# EAGLE design The_QwiicNES (EAGLE 9.5.2)
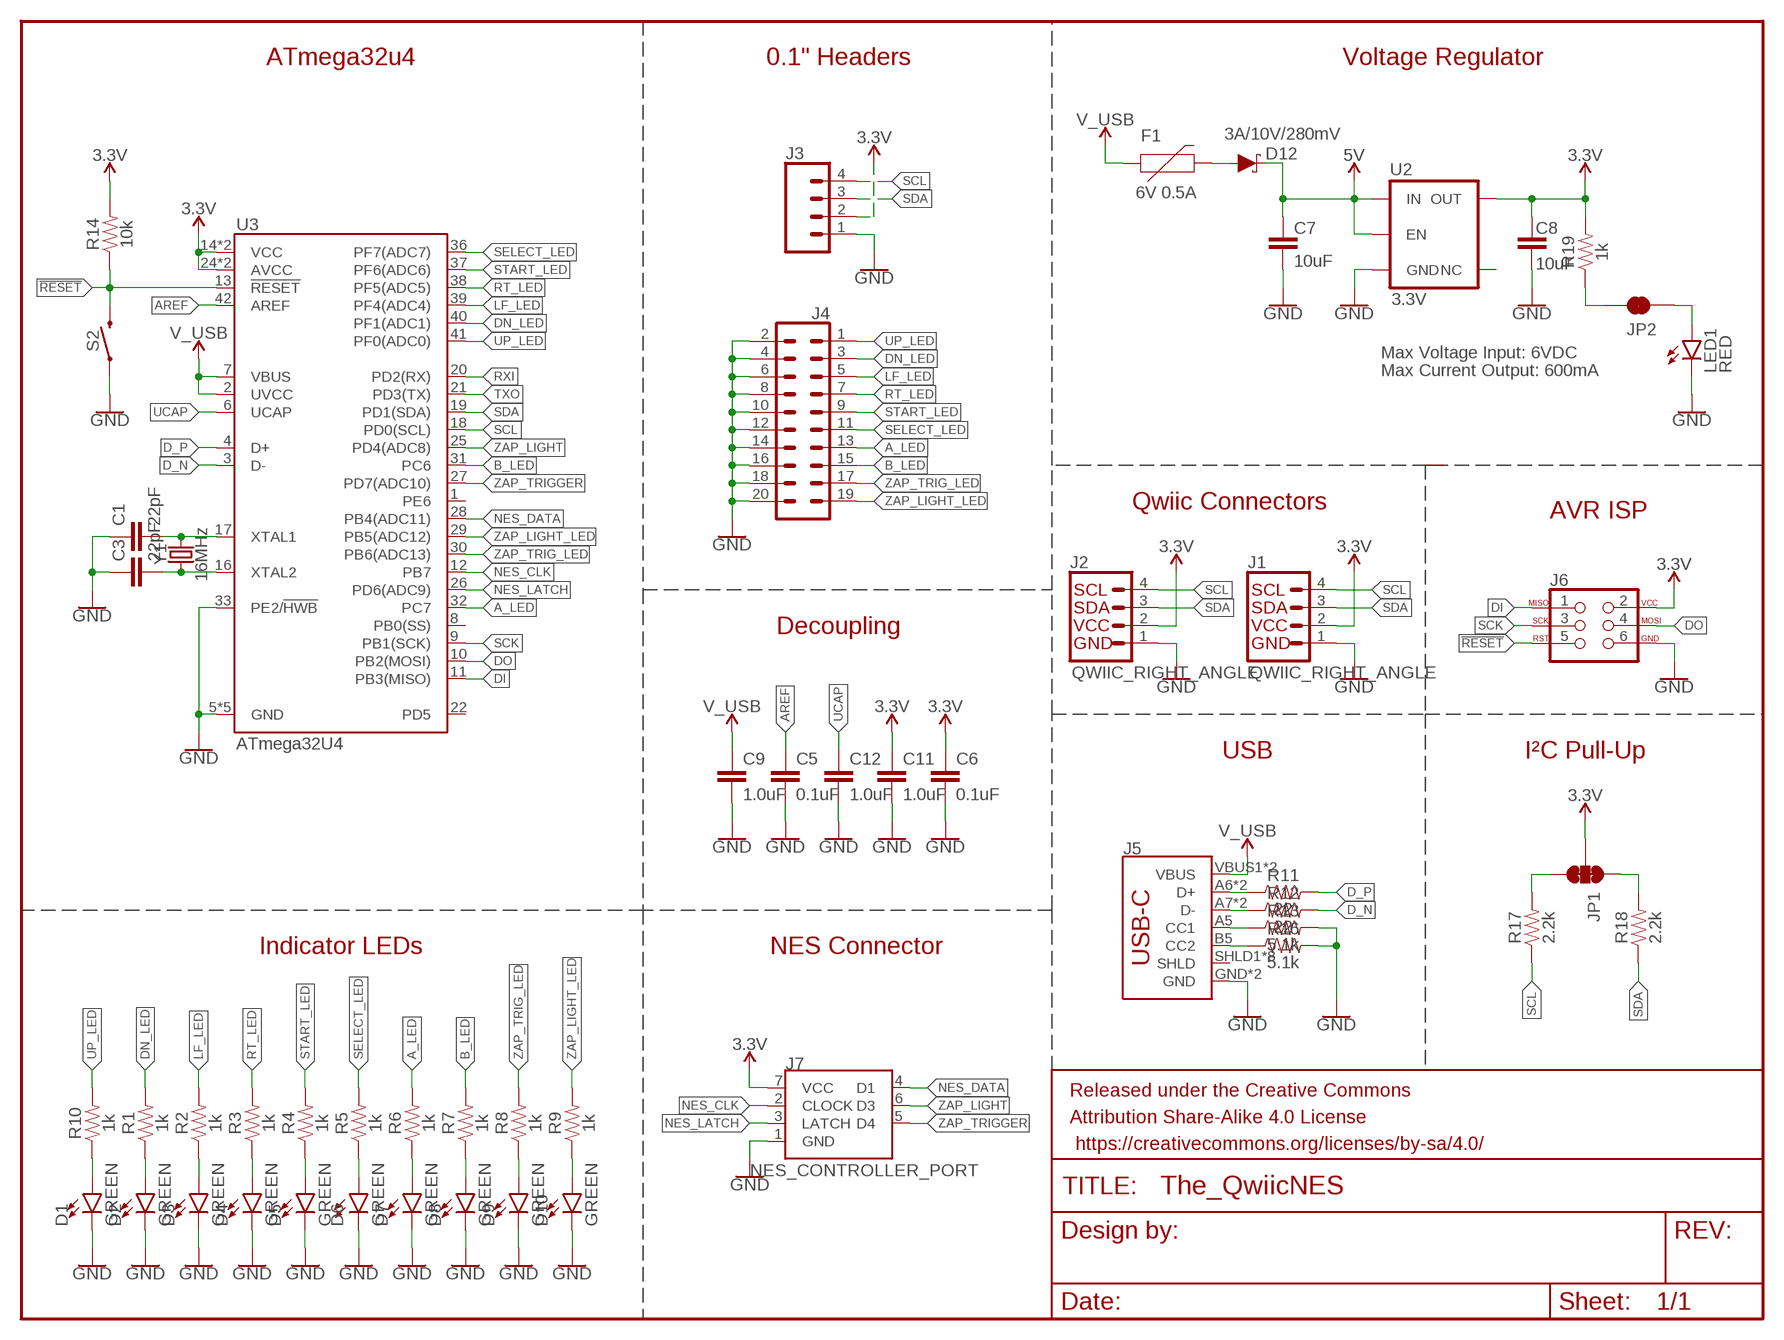
[diagram p0: schematic, sheet 1]

## Parts
C1  22pF  22PF-0603-50V-5%  [0603]
C3  22pF  22PF-0603-50V-5%  [0603]
C5  0.1uF  0.1UF-0603-25V-(+80/-20%)  [0603]
C6  0.1uF  0.1UF-0603-25V-(+80/-20%)  [0603]
C7  10uF  10UF-0603-6.3V-20%  [0603]
C8  10uF  10UF-0603-6.3V-20%  [0603]
C9  1.0uF  1.0UF-0603-16V-10%  [0603]
C11  1.0uF  1.0UF-0603-16V-10%  [0603]
C12  1.0uF  1.0UF-0603-16V-10%  [0603]
D1  GREEN  LED-GREEN0603  [LED-0603]
D2  GREEN  LED-GREEN0603  [LED-0603]
D3  GREEN  LED-GREEN0603  [LED-0603]
D4  GREEN  LED-GREEN0603  [LED-0603]
D5  GREEN  LED-GREEN0603  [LED-0603]
D6  GREEN  LED-GREEN0603  [LED-0603]
D7  GREEN  LED-GREEN0603  [LED-0603]
D8  GREEN  LED-GREEN0603  [LED-0603]
D9  GREEN  LED-GREEN0603  [LED-0603]
D10  GREEN  LED-GREEN0603  [LED-0603]
D12  3A/10V/280mV  DIODE-SCHOTTKY-BAT60A  [SOD-323]
F1  6V 0.5A  PPTC_6V500MA  [0805]
FRAME1  FRAME-LETTER  [CREATIVE_COMMONS]
J1  QWIIC_RIGHT_ANGLE  QWIIC_CONNECTORJS-1MM  [JST04_1MM_RA]
J2  QWIIC_RIGHT_ANGLE  QWIIC_CONNECTORJS-1MM  [JST04_1MM_RA]
J3  CONN_041X04_NO_SILK  [1X04_NO_SILK]
J4  CONN_10X2NOSILK  [2X10_NOSILK]
J5  USB_C5  [USB-C-16P-5]
J6  AVR_SPI_PROG_3X2TESTPOINTS  [2X3_TEST_POINTS]
J7  NES_CONTROLLER_PORT  [NES_CONTROLLER_PORT_7PIN_90]
JP1  JUMPER-SMT_3_2-NC_TRACE_SILK  [SMT-JUMPER_3_2-NC_TRACE_SILK]
JP2  JUMPER-SMT_2_NC_TRACE_SILK  [SMT-JUMPER_2_NC_TRACE_SILK]
LED1  RED  LED-RED0603  [LED-0603]
R1  1k  1KOHM-0603-1/10W-1%  [0603]
R2  1k  1KOHM-0603-1/10W-1%  [0603]
R3  1k  1KOHM-0603-1/10W-1%  [0603]
R4  1k  1KOHM-0603-1/10W-1%  [0603]
R5  1k  1KOHM-0603-1/10W-1%  [0603]
R6  1k  1KOHM-0603-1/10W-1%  [0603]
R7  1k  1KOHM-0603-1/10W-1%  [0603]
R8  1k  1KOHM-0603-1/10W-1%  [0603]
R9  1k  1KOHM-0603-1/10W-1%  [0603]
R10  1k  1KOHM-0603-1/10W-1%  [0603]
R11  22  22OHM-0603-1/10W-1%  [0603]
R12  22  22OHM-0603-1/10W-1%  [0603]
R13  5.1k  5.1KOHM5.1KOHM-0603-1/10W-1%  [0603]
R14  10k  10KOHM-0603-1/10W-1%  [0603]
R16  5.1k  5.1KOHM5.1KOHM-0603-1/10W-1%  [0603]
R17  2.2k  2.2KOHM-0603-1/10W-1%  [0603]
R18  2.2k  2.2KOHM-0603-1/10W-1%  [0603]
R19  1k  1KOHM-0603-1/10W-1%  [0603]
S2  MOMENTARY-SWITCH-SPST-SMD-5.2MM-TALL  [TACTILE_SWITCH_SMD_5.2MM]
U2  3.3V  V_REG_AP2112K-3.3V  [SOT23-5]
U3  ATmega32U4  ATMEGA32U41:1  [QFN-44-NOPAD_1:1]
Y1  16MHz  CRYSTAL-16MHZSMD-2X1.6  [CRYSTAL-SMD-2.0X1.6MM]

## Nets
3.3V: C6.1 C8.2 C11.1 J1.2 J2.2 J3.2 J6.2 J7.7(VCC) JP1.2 R14.2 R19.2 U2.5(OUT) U3.14(VCC) U3.24(AVCC) U3.34(VCC) U3.44(AVCC)
5V [vcc]: C7.2 D12.C U2.1(IN) U2.3(EN)
!RESET: J6.5 R14.1 S2.3 U3.13(!RESET)
A_LED: J4.13 R6.2 U3.32(PC7)
AREF: C5.1 U3.42(AREF)
B_LED: J4.15 R7.2 U3.31(PC6)
D-_HV: J5.A7(D-) J5.B7(D-) R12.1
D_N: R12.2 U3.3(D-)
D_P: R11.2 U3.4(D+)
DI: J6.1 U3.11(PB3(MISO))
DN_LED: J4.3 R1.2 U3.40(PF1(ADC1))
DO: J6.4 U3.10(PB2(MOSI))
DP_HV: J5.A6(D+) J5.B6(D+) R11.1
GND: C1.1 C3.1 C5.2 C6.2 C7.1 C8.1 C9.2 C11.2 C12.2 D1.C D2.C D3.C D4.C D5.C D6.C D7.C D8.C D9.C D10.C J1.1 J2.1 J3.1 J4.2 J4.4 J4.6 J4.8 J4.10 J4.12 J4.14 J4.16 J4.18 J4.20 J5.GND J5.GND2(GND) J6.6 J7.1(GND) LED1.C R13.2 R16.2 S2.1 U2.2(GND) U3.5(GND) U3.15(GND) U3.23(GND) U3.33(PE2/!HWB) U3.35(GND) U3.43(GND)
LF_LED: J4.5 R2.2 U3.39(PF4(ADC4))
N$1: C3.2 U3.16(XTAL2) Y1.1
N$2: C1.2 U3.17(XTAL1) Y1.3
N$3: D1.A R10.1
N$4: D2.A R1.1
N$5: D3.A R2.1
N$6: D4.A R3.1
N$7: D5.A R4.1
N$8: D6.A R5.1
N$9: J5.A5(CC1) R13.1
N$10: J5.B5(CC2) R16.1
N$11: D8.A R7.1
N$12: D7.A R6.1
N$13: JP2.2 R19.1
N$14: JP2.1 LED1.A
N$21: JP1.3 R17.2
N$22: JP1.1 R18.2
N$23: D10.A R9.1
N$24: D9.A R8.1
NES_CLK: J7.2(CLOCK) U3.12(PB7)
NES_DATA: J7.4(D1) U3.28(PB4(ADC11))
NES_LATCH: J7.3(LATCH) U3.26(PD6(ADC9))
RT_LED: J4.7 R3.2 U3.38(PF5(ADC5))
RXI: U3.20(PD2(RX))
SCK: J6.3 U3.9(PB1(SCK))
SCL: J1.4 J2.4 J3.4 R17.1 U3.18(PD0(SCL))
SDA: J1.3 J2.3 J3.3 R18.1 U3.19(PD1(SDA))
SELECT_LED: J4.11 R5.2 U3.36(PF7(ADC7))
START_LED: J4.9 R4.2 U3.37(PF6(ADC6))
TXO: U3.21(PD3(TX))
UCAP: C12.1 U3.6(UCAP)
UP_LED: J4.1 R10.2 U3.41(PF0(ADC0))
USB_RAW: D12.A F1.2
V_USB: C9.1 F1.1 J5.VBUS1(VBUS) J5.VBUS2(VBUS) U3.2(UVCC) U3.7(VBUS)
ZAP_LIGHT: J7.6(D3) U3.25(PD4(ADC8))
ZAP_LIGHT_LED: J4.19 R9.2 U3.29(PB5(ADC12))
ZAP_TRIG_LED: J4.17 R8.2 U3.30(PB6(ADC13))
ZAP_TRIGGER: J7.5(D4) U3.27(PD7(ADC10))
Unconnected: J5.SHLD1(SHLD) J5.SHLD2(SHLD) J5.SHLD3(SHLD) J5.SHLD4(SHLD) J5.SHLD5(SHLD) J5.SHLD6(SHLD) J5.SHLD7(SHLD) J5.SHLD8(SHLD) U2.4(NC) U3.1(PE6) U3.8(PB0(SS)) U3.22(PD5)

## Notes on the sheet
- ATmega32u4 | 0.1" Headers | Voltage Regulator
- Max Voltage Input: 6VDC
- Max Current Output: 600mA
- Qwiic Connectors
- AVR ISP
- Decoupling
- USB | I²C Pull-Up
- Indicator LEDs | NES Connector

## Library data of the parts
C1 C3 = SparkFun-Capacitors:22PF: 22pF ceramic capacitors A capacitor is a passive two-terminal electrical component used to store electrical energy temporarily in an electric field.; PROD_ID: CAP-07876
C5 C6 = SparkFun-Capacitors:0.1UF: 0.1µF ceramic capacitors A capacitor is a passive two-terminal electrical component used to store electrical energy temporarily in an electric field.; PROD_ID: CAP-00810
C7 C8 = SparkFun-Capacitors:10UF: 10.0µF ceramic capacitors A capacitor is a passive two-terminal electrical component used to store electrical energy temporarily in an electric field.; PROD_ID: CAP-11015
C9 C11 C12 = SparkFun-Capacitors:1.0UF: 1µF ceramic capacitors A capacitor is a passive two-terminal electrical component used to store electrical energy temporarily in an electric field.; PROD_ID: CAP-00868
D1-D10 = SparkFun-LED:LED-GREEN: Green SMD LED Used in manufacturing of various products at SparkFun Packages: 0603 - SMD 0603 package [Product Link] <http://www.futureelectronics.com/en/technologies/semiconductors/optoelectronics/leds/Pages/9894312-LTST-C190GKT.aspx?CrossPart=HSMG-C190&IM=0> LilyPad 1206 - SMD1206 LilyPad package [Product Link] <http://www.futureelectronics.com/en/Technologies/Product.aspx?ProductID=IN150NGHARVATEKCORPORATION2049943&IM=0> 1206 - SMD1206 package [Product Link] <http://www.futureelectronics.com/en/technologies/semiconductors/optoelectronics/leds/Pages/8315665-LTST-C150KGKT.aspx?IM=0> 1206 Bottom Mount -SMD 1206 Bottom Mount [Product Link] <http://www.digikey.com/product-detail/en/lite-on-inc/LTST-C230KGKT/160-1456-1-ND/386854> SparkFun Products: Pro Mini 328 -5V <https://www.sparkfun.com/products/821> RedBoard <https://www.sparkfun.com/products/12757> MP3 Trigger <https://www.sparkfun.com/products/13720> Makey Makey <https://www.sparkfun.com/products/11076>; PROD_ID: DIO-00821
D12 = SparkFun-DiscreteSemi:DIODE-SCHOTTKY: Schottky diode A Schottky diode is a semiconductor diode which has a low forward voltage drop and a very fast switching action.; PROD_ID: DIO-14072
F1 = SparkFun-Fuses:PPTC: Resettable Fuse PPTC Resettable Fuse. Really a sort of resistor with a polymeric positive temperature coefficient whose resistance increases dramatically with an increase in temperature. When heated by the power passing through the resistance rises causing the current to be limited, protecting the circuit. This is achieved by the transition of the polymer from a crystalline to an amorphous state where the conductive carbon separates breaking the conductive pathways found in the cool crystalline structure. When a PPTC cools back down it resumes conducting letting the circuit turn back on. SparkFun Products: SparkFun RedBoard - Programmed with Arduino <https://www.sparkfun.com/products/12757> Pro Micro - 5V/16MHz <https://www.sparkfun.com/products/12640> Arduino Pro 328 - 5V/16MHz <https://www.sparkfun.com/products/10915> MP3 Trigger <https://www.sparkfun.com/products/13720>; PROD_ID: RES-13945
FRAME1 = SparkFun-Aesthetics:FRAME-LETTER: Schematic Frame - Letter Standard 8.5x11 US Letter frame
J1 J2 = SparkFun-Connectors:QWIIC_CONNECTOR: SparkFun I2C Standard Qwiic Connector An SMD 1mm pitch JST connector makes it easy and quick (get it? Qwiic?) to connect I2C devices to each other. The Qwiic system <http://www.sparkfun.com/qwiic> enables fast and solderless connection between popular platforms and various sensors and actuators. We carry 200mm <https://www.sparkfun.com/products/14204>, 100mm <https://www.sparkfun.com/products/14205>, 50mm <https://www.sparkfun.com/products/14206>, and breadboard friendly <https://www.sparkfun.com/products/14207> Qwiic cables. We also offer 10 pcs strips <https://www.sparkfun.com/products/14323> the SMD connectors.; PROD_ID: CONN-13694
J3 = SparkFun-Connectors:CONN_04: Multi connection point. Often used as Generic Header-pin footprint for 0.1 inch spaced/style header connections On any of the 0.1 inch spaced packages, you can populate with these: Break Away Headers - Straight <https://www.sparkfun.com/products/116> (PRT-00116) Break Away Male Headers - Right Angle <https://www.sparkfun.com/products/553> (PRT-00553) Female Headers <https://www.sparkfun.com/products/115> (PRT-00115) Break Away Headers - Machine Pin <https://www.sparkfun.com/products/117> (PRT-00117) Break Away Female Headers - Swiss Machine Pin <https://www.sparkfun.com/products/743> (PRT-00743) For SCREWTERMINALS and SPRING TERMINALS visit here: Screw Terimnals on SparkFun.com <https://www.sparkfun.com/search/results?term=Screw+Terminals> (5mm/3.5mm/2.54mm spacing) This device is also useful as a general connection point to wire up your design to another part of your project. Our various solder wires solder well into these plated through hole pads. Hook-Up Wire - Assortment (Stranded, 22 AWG) <https://www.sparkfun.com/products/11375> (PRT-11375) Hook-Up Wire - Assortment (Solid Core, 22 AWG) <https://www.sparkfun.com/products/11367> (PRT-11367) View the entire wire category on our website here <https://www.sparkfun.com/categories/141> Special notes: Molex polarized connector foot print use with SKU : PRT-08231 with associated crimp pins and housings. 1MM SMD Version SKU: PRT-10208; PROD_ID: CONN-09696
J4 = SparkFun-Connectors:CONN_10X2: Multi connection point. Often used as Generic Header-pin footprint for 0.1 inch spaced/style header connections On any of the 0.1 inch spaced packages, you can populate with these: Break Away Headers - Straight <https://www.sparkfun.com/products/116> (PRT-00116) Break Away Male Headers - Right Angle <https://www.sparkfun.com/products/553> (PRT-00553) Female Headers <https://www.sparkfun.com/products/115> (PRT-00115) Break Away Headers - Machine Pin <https://www.sparkfun.com/products/117> (PRT-00117) Break Away Female Headers - Swiss Machine Pin <https://www.sparkfun.com/products/743> (PRT-00743) Special note about the "SPECIAL" package: This was SPECIALLY designed to be used with our Graphic LCD Backpack. Be sure you want to use this! It is not only staggered on each line of header holes, but IT IS ALSO offset of the center point of the top and bottom lines by 5 mil. This causes the headers to lock into place on the "standard" footprint on the LCD screen. The extra squares on the tdocu layer are there simply to reference other pins (if you were to actually populate a longer header than ten long - this is what we do with the backpacks).
J5 = USBC:USB_C: USB Type C 16Pin Connector Super Speed pins not available on the 16-pin purely SMD connector so this part is best for USB 2.0 implementations. D1 and D2 are tied together enabling D+/- no matter which way the cable is plugged into the connector. The two channel configuration pins (CC1/2) are exposed. These are normally connected to ground via 5.1k resistors but can be reconfigured for high current/high power applications.
J6 = SparkFun-Connectors:AVR_SPI_PROG_3X2: AVR ISP 6 Pin This is the reduced ISP connector for AVR programming. Common on Arduino. This footprint will take up less PCB space and can be used with a 10-pin to 6-pin adapter such as SKU: BOB-08508 **Special note about "TEST_POINT" package. The stop mask is on the top side, so if you want your programming test points to be on the bottom of your board, make sure to place this package on the bottom side of the board. This also ensure that the orientation to program from the bottom side will be correct. SparkFun Products: SparkFun ISP Pogo Adapter <https://www.sparkfun.com/products/11591> - NS Tiny AVR Programmer <https://www.sparkfun.com/products/11801> -PTH
J7 = NES:NES_CONTROLLER_PORT
JP1 = SparkFun-Jumpers:JUMPER-SMT_3_2-NC_TRACE: Normally closed trace jumper (2 of 2 connections) This jumper has a trace between all three pads so they are normally closed (NC). Use a razor knife to open the connection(s). For best results follow the IPC guidelines for cutting traces: Cutout at least 0.063 mm (0.005 in). Remove all loose material to clean up the cut area. Seal the cut with an approved epoxy. Reapply solder to reclose the connection(s).
JP2 = SparkFun-Jumpers:JUMPER-SMT_2_NC_TRACE: Normally closed trace jumper This jumper has a trace between two pads so it's normally closed (NC). Use a razor knife to open the connection. For best results follow the IPC guidelines for cutting traces: Cutout at least 0.063 mm (0.005 in). Remove all loose material to clean up the cut area. Seal the cut with an approved epoxy. Reapply solder to reclose the connection.
LED1 = SparkFun-LED:LED-RED: Red SMD LED Used in manufacturing of most products at SparkFun Packages: 0603 - SMD 0603 package [Product Link] <http://docs.avagotech.com/docs/AV02-0551EN> 0603 SMART - SMD 0603 SMART package ( more efficient and expensive)[Product Link] <http://www.osram-os.com/Graphics/XPic2/00077099_0.pdf> 1206 - SMD1206 package [Product Link] <https://www.sparkfun.com/datasheets/DevTools/LilyPad/Q150OVS4.pdff> SparkFun Products: Pro Mini 328 -5V <https://www.sparkfun.com/products/821> RedBoard <https://www.sparkfun.com/products/12757> IOIO-OTG <https://www.sparkfun.com/products/13613>; PROD_ID: DIO-00819
R1-R10 R19 = SparkFun-Resistors:1KOHM: 1kΩ resistor A resistor is a passive two-terminal electrical component that implements electrical resistance as a circuit element. Resistors act to reduce current flow, and, at the same time, act to lower voltage levels within circuits. - Wikipedia; PROD_ID: RES-07856
R11 R12 = SparkFun-Resistors:22OHM: 22Ω resistor A resistor is a passive two-terminal electrical component that implements electrical resistance as a circuit element. Resistors act to reduce current flow, and, at the same time, act to lower voltage levels within circuits. - Wikipedia; PROD_ID: RES-08698
R13 R16 = SparkFun-Resistors:5.1KOHM; PROD_ID: RES-12083
R14 = SparkFun-Resistors:10KOHM: 10kΩ resistor A resistor is a passive two-terminal electrical component that implements electrical resistance as a circuit element. Resistors act to reduce current flow, and, at the same time, act to lower voltage levels within circuits. - Wikipedia; PROD_ID: RES-00824
R17 R18 = SparkFun-Resistors:2.2KOHM: 2.2kΩ resistor A resistor is a passive two-terminal electrical component that implements electrical resistance as a circuit element. Resistors act to reduce current flow, and, at the same time, act to lower voltage levels within circuits. - Wikipedia; PROD_ID: RES-08272
S2 = SparkFun-Switches:MOMENTARY-SWITCH-SPST: Momentary Switch (Pushbutton) - SPST Normally-open (NO) SPST momentary switches (buttons, pushbuttons). Variants PTH-12MM - 12mm square, through-hole Momentary Pushbutton Switch - 12mm Square <https://www.sparkfun.com/products/9190> (COM-09190) PTH-6.0MM, PTH-6.0MM-KIT - 6.0mm square, through-hole Mini Pushbutton Switch <https://www.sparkfun.com/products/97> (COM-00097) KIT package intended for soldering kit's - only one side of pads' copper is exposed. PTH-RIGHT-ANGLE-KIT - Right-angle, through-hole Right Angle Tactile Button <https://www.sparkfun.com/products/10791> - Used on SparkFun BigTime Watch Kit <https://www.sparkfun.com/products/11734> SMD-12MM - 12mm square, surface-mount Tactile Button - SMD (12mm) <https://www.sparkfun.com/products/12993> (COM-12993) Used on SparkFun PicoBoard <https://www.sparkfun.com/products/11888> SMD-4.5MM - 4.5mm Square Trackball Switch Used on SparkFun Blackberry Trackballer Breakout <https://www.sparkfun.com/products/13169> SMD-4.6MMX2.8MM - 4.60mm x 2.80mm, surface mount Used on SparkFun SAMD21 Mini Breakout <https://www.sparkfun.com/products/13664> SMD-5.2MM, SMD-5.2-REDUNDANT - 5.2mm square, surface-mount Mini Pushbutton Switch - SMD <https://www.sparkfun.com/products/8720> (COM-08720) Used on Arduino Pro Mini <https://www.sparkfun.com/products/11114> REDUNDANT package connects both switch circuits together SMD-6.0X3.5MM - 6.0 x 3.5mm, surface mount Momentary Reset Switch SMD <https://www.sparkfun.com/products/8229> (COM-08229) SMD-6.2MM-TALL - 6.2mm square, surface mount Tactile Button - SMD (6mm) <https://www.sparkfun.com/products/12992> Used on SparkFun Digital Sandbox <https://www.sparkfun.com/products/12651> SMD-RIGHT-ANGLE - Right-angle, surface mount Used on SparkFun Block for Intel® Edison - Arduino <https://www.sparkfun.com/products/13036>; PROD_ID: SWCH-14139
U2 = SparkFun-IC-Power:V_REG_AP2112: AP2112 - 600mA CMOS LDO Regulator w/ Enable The AP2112 is CMOS process low dropout linear regulator with enable function, the regulator delivers a guaranteed 600mA (min.) continuous load current. Features Output Voltage Accuracy: ±1.5% Output Current: 600mA (Min.) Foldback Short Current Protection: 50mA Enable Function to Turn ON/OFF VOUT Low Dropout Voltage (3.3V): 250mV (Typ.) @IOUT=600mA Excellent Load Regulation: 0.2%/A (Typ.) Excellent Line Regulation: 0.02%/V (Typ.) Low Quiescent Current: 55μA (Typ.) Low Standby Current: 0.01μA (Typ.) Low Output Noise: 50μVRMS PSRR: 100Hz -65dB, 1kHz -65dB OTSD Protection Stable with 1.0μF Flexible Cap: Ceramic, Tantalum and Aluminum Electrolytic Operation Temperature Range: -40°C to 85°C ESD: MM 400V, HBM 4000V; PROD_ID: VREG-12457
U3 = SparkFun-IC-Microcontroller:ATMEGA32U4: Atmel MCU, 32KByte Atmel 44-pin 8-bit Microcontroller with 32KBytes of ISP Flash and USB Controller Datasheet <http://cdn.sparkfun.com/datasheets/Dev/Arduino/Boards/ATMega32U4.pdf> SparkFun Products LilyPad Arduino USB - ATmega32U4 Board <https://www.sparkfun.com/products/12049> (DEV-12049) Pro Micro - 5V/16MHz <https://www.sparkfun.com/products/12640> (DEV-12640) Pro Micro - 3.3V/8MHz <https://www.sparkfun.com/products/12587> (DEV-12587) Fio v3 - ATmega32U4 <https://www.sparkfun.com/products/11520> (DEV-11520) Qduino Mini <https://www.sparkfun.com/products/13614> (DEV-13614) Makey Makey - Standard Kit <https://www.sparkfun.com/products/11511> (WIG-11511) Makey Makey Deluxe Kit <https://www.sparkfun.com/products/11519> (WIG-11519); PROD_ID: IC-10828; VALUE: 32U4
Y1 = SparkFun-Clocks:CRYSTAL-16MHZ: 16MHz Crystal Digikey Example <http://www.digikey.com/product-search/en?keywords=535-9122-1-ND> Frequency: 16MHz Frequency Stability: ±50ppm Frequency Tolerance: ±20ppm Load Capacitance: 18pF SparkFun Products: Pro Micro -5V/16MHz <https://www.sparkfun.com/products/12640> SparkFun Serial Enabled LCD Kit <https://www.sparkfun.com/products/10097>; PROD_ID: XTAL-14681

## Net classes
0 default: width 0 mm, drill 0 mm

## Board
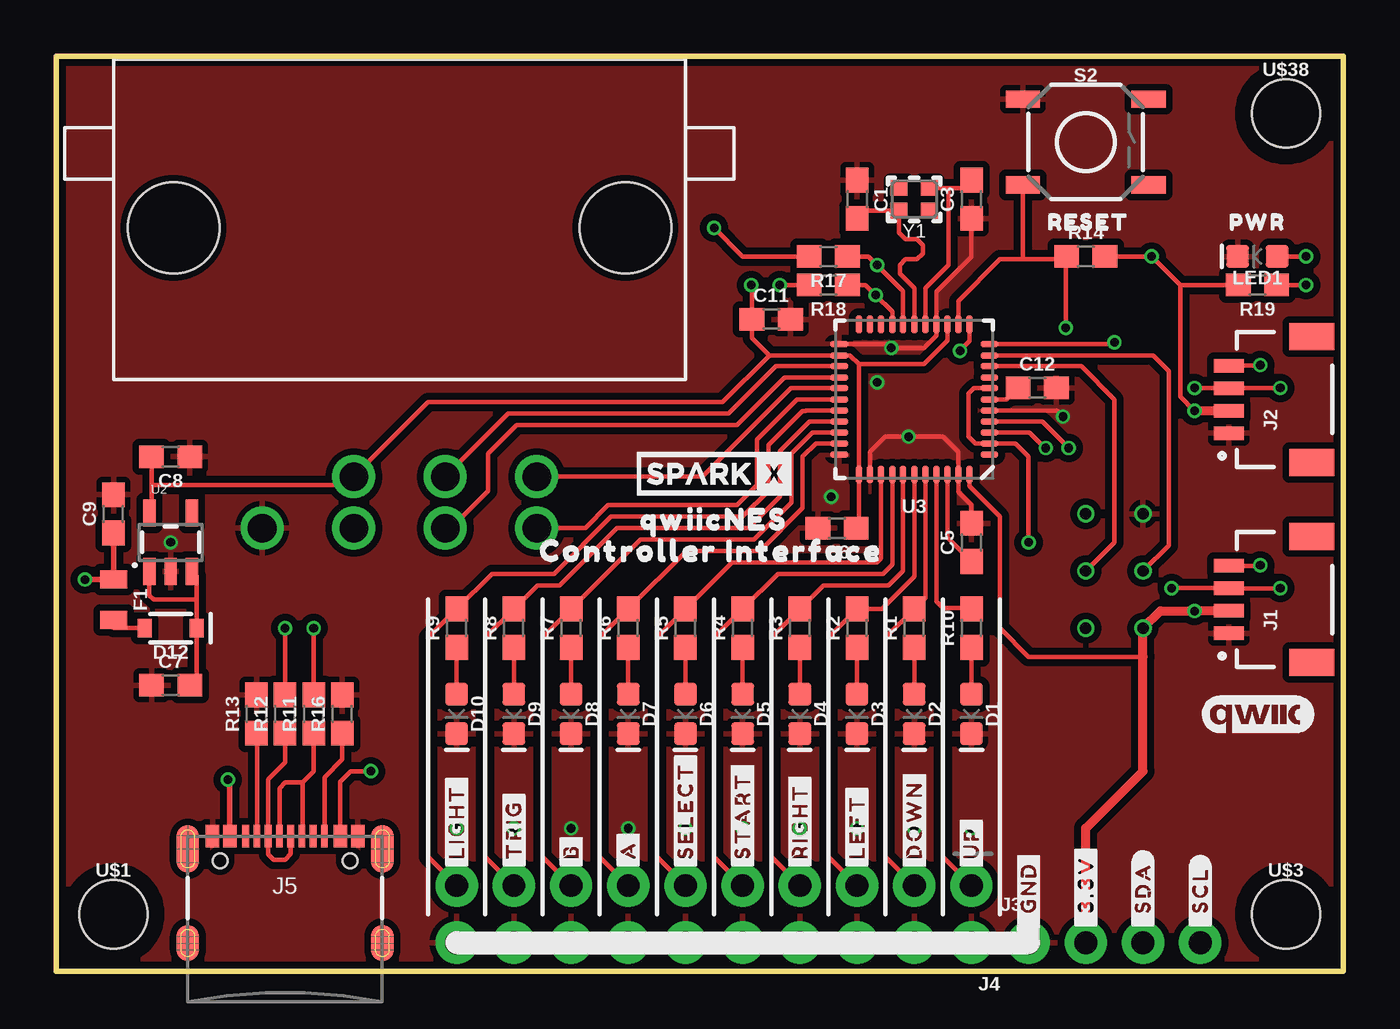
[diagram p1: board, top side]
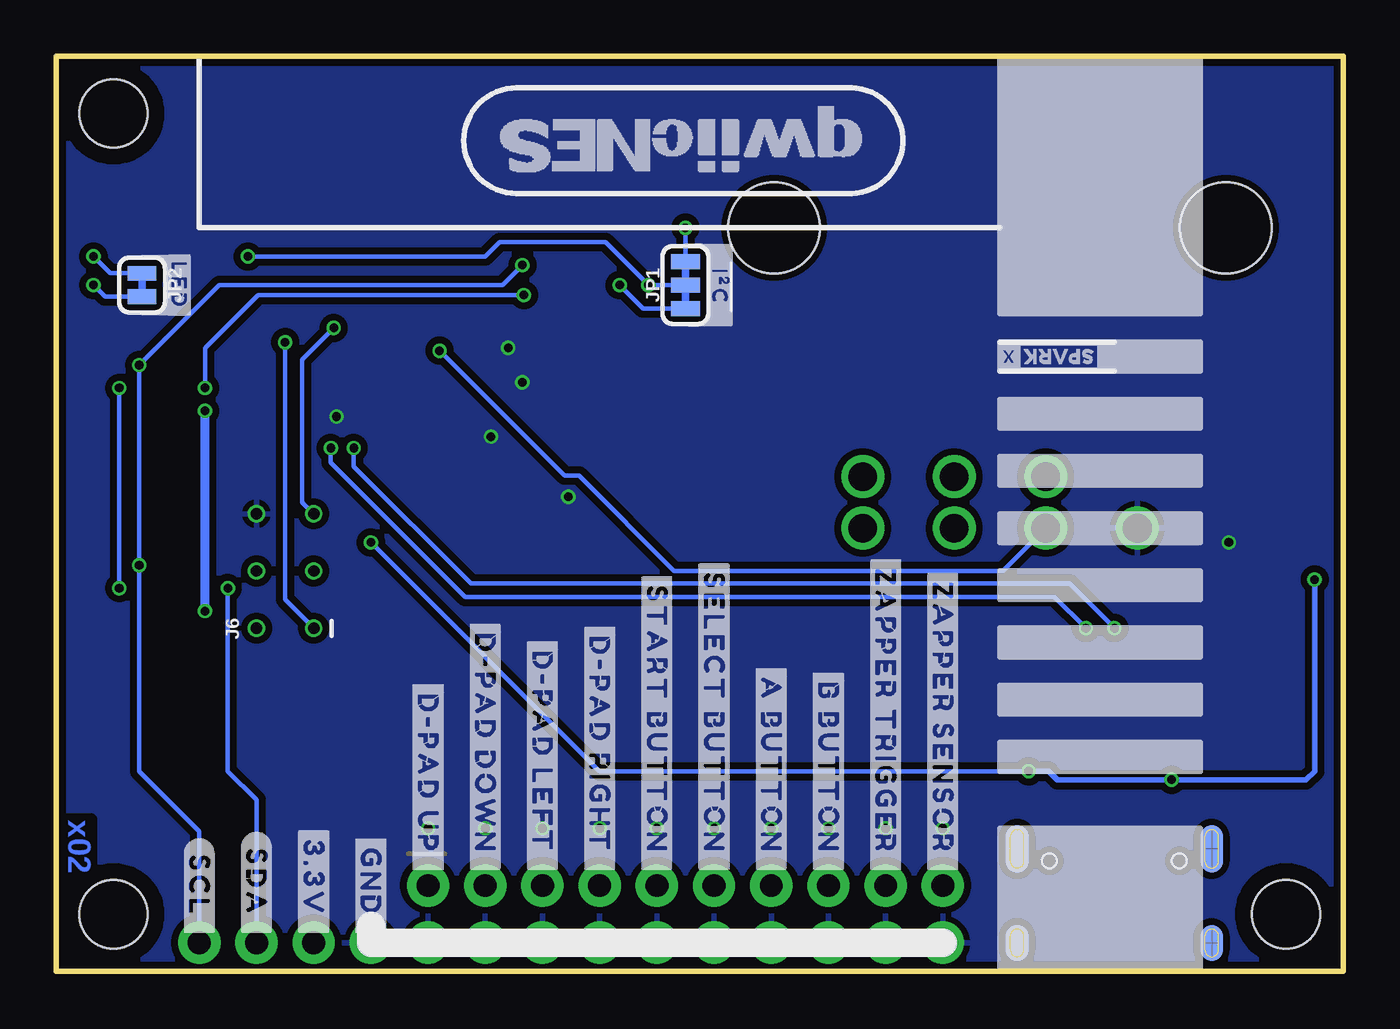
[diagram p2: board, bottom side, seen from below]

Size 57.15 x 40.64 mm. Coordinates in mm from the lower left corner, seen from the top.
Outline: 0,0 0,40.64 57.15,40.64 57.15,0 0,0
Copper layers (1*16): Top 0.035mm / dielectric 1.5mm / Bottom 0.035mm
Design rules "SparkFun-2-Layer-Minimum-JLCPCB": minimum track width 5mil, minimum drill 0.3mm, track to track 5mil, track to pad 5mil, pad to pad 5mil, via to via 5mil, smd to smd 5mil, copper to edge 7mil, drill to drill 7mil, minimum pad ring 5mil, minimum via ring 5mil, stop-mask expansion 4mil, vias tented up to drill 25mil, thermal gap 10mil

### Footprints (pad centres in the part's own frame; a part is rotated, then mirrored left to right if it is on the bottom)
0603 = smd 1.1 x 1: 1 -0.85,0; 2 0.85,0
LED-0603 = smd 1 x 1: A -0.877,0; C 0.877,0
SOD-323 = smd 0.63 x 0.83: A 1.15,0; C -1.15,0
0805 = smd 0.8 x 1.2: 1 -0.9,0; 2 0.9,0
JST04_1MM_RA = smd 0.6 x 1.35: 1 -1.5,0; 2 -0.5,0; 3 0.5,0; 4 1.5,0 | smd 1.2 x 2: NC1 2.8,-3.675; NC2 -2.8,-3.675
1X04_NO_SILK = drill 1.016 pad 1.88: 1 0,0; 2 2.54,0; 3 5.08,0; 4 7.62,0
2X10_NOSILK = drill 1.016 pad 1.88: 1 0,0; 2 0,2.54; 3 2.54,0; 4 2.54,2.54; 5 5.08,0; 6 5.08,2.54; 7 7.62,0; 8 7.62,2.54; 9 10.16,0; 10 10.16,2.54; 11 12.7,0; 12 12.7,2.54; 13 15.24,0; 14 15.24,2.54; 15 17.78,0; 16 17.78,2.54; 17 20.32,0; 18 20.32,2.54; 19 22.86,0; 20 22.86,2.54
USB-C-16P-5 = smd 0.3 x 1: A5 -1.25,-0.34; A6 -0.25,-0.34; A7 0.25,-0.34; A8 1.25,-0.34; B5 1.75,-0.34; B6 0.75,-0.34; B7 -0.75,-0.34; B8 -1.75,-0.34 | smd 0.6 x 1: GND -3.225,-0.34; GND2 3.225,-0.34; VBUS1 -2.45,-0.34; VBUS2 2.45,-0.34 | smd 1 x 2.1: SHLD1 -4.32,-0.915; SHLD2 4.32,-0.915 | smd 1 x 2.1 bottom: SHLD3 -4.32,-0.915; SHLD4 4.32,-0.915 | smd 1 x 1.6: SHLD5 -4.32,-5.095; SHLD8 4.32,-5.095 | smd 1 x 1.6 bottom: SHLD6 -4.32,-5.095; SHLD7 4.32,-5.095 | hole 0.65: -2.89,-1.445; 2.89,-1.445
2X3_TEST_POINTS = drill 0.508: 1 -2.54,-1.27; 2 -2.54,1.27; 3 0,-1.27; 4 0,1.27; 5 2.54,-1.27; 6 2.54,1.27
NES_CONTROLLER_PORT_7PIN_90 = drill 1.27: 1 -6.096,-13.335; 2 -2.032,-13.335; 3 2.032,-13.335; 4 6.096,-13.335; 5 6.096,-11.049; 6 2.032,-11.049; 7 -2.032,-11.049 | hole 4.064: -10.033,0; 10.033,0
SMT-JUMPER_3_2-NC_TRACE_SILK = smd 0.66 x 1.27: 1 -1.041,0; 2 0,0; 3 1.041,0
SMT-JUMPER_2_NC_TRACE_SILK = smd 0.66 x 1.27: 1 -0.521,0; 2 0.521,0
TACTILE_SWITCH_SMD_5.2MM = smd 1.524 x 0.762: 1 -2.794,1.905; 2 2.794,1.905; 3 -2.794,-1.905; 4 2.794,-1.905
SOT23-5 = smd 0.55 x 1.2: 1 -0.95,-1.3; 2 0,-1.3; 3 0.95,-1.3; 4 0.95,1.3; 5 -0.95,1.3
QFN-44-NOPAD_1:1-LESS_PASTE = smd 0.8 x 0.3: 1 -3.337,2.458; 2 -3.337,1.958; 3 -3.337,1.479; 4 -3.337,0.979; 5 -3.337,0.5; 6 -3.337,0; 7 -3.337,-0.5; 8 -3.337,-0.979; 9 -3.337,-1.479; 10 -3.337,-1.958; 11 -3.337,-2.458; 23 3.337,-2.458; 24 3.337,-1.958; 25 3.337,-1.479; 26 3.337,-0.979; 27 3.337,-0.5; 28 3.337,0; 29 3.337,0.5; 30 3.337,0.979; 31 3.337,1.479; 32 3.337,1.958; 33 3.337,2.458 | smd 0.3 x 0.8: 12 -2.458,-3.337; 13 -1.958,-3.337; 14 -1.479,-3.337; 15 -0.979,-3.337; 16 -0.5,-3.337; 17 0,-3.337; 18 0.5,-3.337; 19 0.979,-3.337; 20 1.479,-3.337; 21 1.958,-3.337; 22 2.458,-3.337; 34 2.458,3.337; 35 1.958,3.337; 36 1.479,3.337; 37 0.979,3.337; 38 0.5,3.337; 39 0,3.337; 40 -0.5,3.337; 41 -0.979,3.337; 42 -1.479,3.337; 43 -1.958,3.337; 44 -2.458,3.337
STAND-OFF-TIGHT = hole 3.048: 0,0
CRYSTAL-SMD-2.0X1.6MM = smd 0.75 x 0.7: 1 -0.675,-0.5; 2 0.675,-0.5; 3 0.675,0.5; 4 -0.675,0.5

### Placement (x,y rotation side)
C1  35.56,34.29 270 top
C3  40.64,34.29 90 top
C5  40.64,19.05 90 top
C6  34.67,19.68 180 top
C7  5.08,12.7 0 top
C8  5.08,22.86 180 top
C9  2.54,20.32 90 top
C11  31.75,28.96 0 top
C12  43.56,25.91 0 top
D1  40.64,11.43 270 top
D2  38.1,11.43 270 top
D3  35.56,11.43 270 top
D4  33.02,11.43 270 top
D5  30.48,11.43 270 top
D6  27.94,11.43 270 top
D7  25.4,11.43 270 top
D8  22.86,11.43 270 top
D9  20.32,11.43 270 top
D10  17.78,11.43 270 top
D12  5.08,15.24 180 top
F1  2.54,16.51 270 top
FRAME1  7.62,-20.32 0 top  (outside the outline)
J1  52.07,16.51 90 top
J2  52.07,25.4 90 top
J3  43.18,1.27 0 top
J4  40.64,3.81 180 top
J5  10.16,6.35 0 top
J6  46.99,17.78 90 bottom
J7  15.24,33.02 0 top
JP1  29.21,30.48 90 bottom
JP2  53.34,30.48 270 bottom
LED1  53.34,31.75 180 top
R1  38.1,15.24 90 top
R2  35.56,15.24 90 top
R3  33.02,15.24 90 top
R4  30.48,15.24 90 top
R5  27.94,15.24 90 top
R6  25.4,15.24 90 top
R7  22.86,15.24 90 top
R8  20.32,15.24 90 top
R9  17.78,15.24 90 top
R10  40.64,15.24 90 top
R11  11.43,11.43 90 top
R12  10.16,11.43 90 top
R13  8.89,11.43 90 top
R14  45.72,31.75 0 top
R16  12.7,11.43 90 top
R17  34.29,31.75 180 top
R18  34.29,30.48 180 top
R19  53.34,30.48 180 top
S2  45.72,36.83 0 top
U2  5.08,19.05 0 top
U3  32U4  [QFN-44-NOPAD_1:1-LESS_PASTE]  38.1,25.4 180 top
U$1  [STAND-OFF-TIGHT]  2.54,2.54 0 top
U$2  [SPARKX-SMALL]  29.21,22.1 0 top
U$3  [STAND-OFF-TIGHT]  54.61,2.54 0 top
U$4  [#LIGHT#0]  17.78,4.45 90 top
U$5  [#TRIG#0]  20.32,4.45 90 top
U$6  [#B#0]  22.86,4.45 90 top
U$7  [#A#0]  25.4,4.45 90 top
U$8  [#SELECT#0]  27.94,4.45 90 top
U$9  [#START#0]  30.48,4.45 90 top
U$10  [#RIGHT#0]  33.02,4.45 90 top
U$11  [#LEFT#0]  35.56,4.45 90 top
U$12  [#DOWN#0]  38.1,4.45 90 top
U$13  [#UP#0]  40.64,4.45 90 top
U$14  [#_GND#0]  43.18,1.78 90 top
U$15  [#_SDA#0]  48.26,1.78 90 top
U$16  [#_SCL#0]  50.8,1.78 90 top
U$17  [#_3#3V#0]  45.72,1.78 90 top
U$18  [PWR0]  53.34,33.27 0 top
U$19  [RESET0]  45.85,33.27 0 top
U$20  [SPARKX-TINY]  13.08,27.3 180 bottom
U$21  [#ZAPPER_SENSOR_#0]  17.78,4.19 270 bottom
U$22  [#ZAPPER_TRIGGER_#0]  20.32,4.19 270 bottom
U$23  [#B_BUTTON_#0]  22.86,4.19 270 bottom
U$24  [#A_BUTTON_#0]  25.4,4.19 270 bottom
U$25  [#SELECT_BUTTON_#0]  27.94,4.19 270 bottom
U$26  [#START_BUTTON_#0]  30.48,4.19 270 bottom
U$27  [#D#PAD_RIGHT_#0]  33.02,4.19 270 bottom
U$28  [#D#PAD_LEFT_#0]  35.56,4.19 270 bottom
U$29  [#D#PAD_DOWN_#0]  38.1,4.19 270 bottom
U$30  [#D#PAD_UP_#0]  40.64,4.19 270 bottom
U$31  [#GND_#0]  43.18,1.4 270 bottom
U$32  [#SDA_#0]  48.26,1.4 270 bottom
U$33  [#SCL_#0]  50.8,1.4 270 bottom
U$34  [#3#3V_#0]  45.72,1.4 270 bottom
U$35  [#I�C#0]  27.69,29.08 270 bottom
U$36  [#LED#0]  51.69,30.48 270 bottom
U$37  [QWIICNESS#PNG]  29.21,36.83 180 bottom
U$38  [STAND-OFF-TIGHT]  54.61,38.1 0 top
U$39  [QWIICNES0]  29.21,20.07 0 top
U$40  [CONTROLLER_INTERFACE0]  29.08,18.67 0 top
U$41  [QWIIC_5MM]  53.34,11.43 0 top
Y1  38.1,34.29 180 top

### Tracks (layer width: path | path; a pad name or v marks a point on that pad's centre or on a via)
3.3V  (via drill 0.38)
  Top 0.203: U3.14 39.58,28.02 38.53,26.97 35.64,26.97 | 35.64,26.97 U3.34 35.64,19.81 C6.1 | 35.64,26.97 35.25,27.36 U3.24 31.68,27.36 | C8.2 4.23,21.59 | 4.23,21.59 4.23,20.45 U2.5 | 31.68,27.36 29.59,25.27 16.51,25.27 J7.7 12.83,21.59 4.23,21.59 | v50.55,24.89 49.91,25.53 49.91,30.48 | U3.44 40.56,21.55 41.91,20.19 41.91,15.24 43.18,13.97 48.26,13.97 | v30.86,30.48 30.9,30.44 C11.1 30.9,28.13 31.68,27.36 | R14.2 v48.64,31.75 49.91,30.48 | 49.91,30.48 R19.2
  Top 0.406: J1.2 v50.55,16.01 | v50.55,16.01 v50.55,16 | v50.55,24.89 v50.55,24.9 J2.2 | v50.55,16.01 49.03,16.01 J6.2 48.26,13.97 48.26,8.89 45.72,6.35 J3.2
  Bottom 0.203: JP1.2 v30.86,30.48 32.77,32.38 37.47,32.38 38.1,31.75 v48.64,31.75
  Bottom 0.406: v50.55,16 v50.55,24.89
5V
  Top 0.203: U2.3 6.23,17.55 6.23,16.51 | 6.23,16.51 D12.C 6.23,13 C7.2 | U2.1 4.13,16.7 4.32,16.51 6.23,16.51
!RESET  (via drill 0.38)
  Top 0.203: U3.13 40.06,29.77 41.91,31.62 42.93,31.62 | S2.3 42.93,31.62 | R14.1 44.74,31.62 | 44.74,31.62 42.93,31.62 | v44.83,28.57 44.83,31.54 44.74,31.62
  Bottom 0.203: J6.5 46.23,20.83 46.23,27.18 v44.83,28.57
A_LED
  Top 0.203: U3.32 33.73,23.44 33.15,22.86 33.15,20.57 31.24,18.67 27.98,18.67 R6.2 24.13,14.82 24.13,5.08 J4.13
AREF
  Top 0.203: U3.42 39.58,19.26 C5.1
B_LED
  Top 0.203: U3.31 33.57,23.92 32.64,22.99 32.64,20.83 30.99,19.18 25.95,19.18 R7.2 21.59,14.82 21.59,5.08 J4.15
D-_HV
  Top 0.203: J5.A7 10.41,5.21 10.16,4.95 9.65,4.95 9.41,5.2 J5.B7 9.41,8.52 10.16,9.27 R12.1
D_N  (via drill 0.38)
  Top 0.203: U3.3 43.22,23.92 43.9,23.24 v43.94,23.24 | v10.16,15.24 R12.2
  Bottom 0.203: v43.94,23.24 43.94,22.43 38.73,17.22 12.14,17.22 v10.16,15.24
D_P  (via drill 0.38)
  Top 0.203: U3.4 43.79,24.42 44.96,23.25 v44.96,23.24 | v11.43,15.24 R11.2
  Bottom 0.203: v44.96,23.24 44.96,22.61 44.27,21.92 44.27,21.91 39,16.64 12.83,16.64 v11.43,15.24
DI  (via drill 0.38)
  Top 0.203: v46.99,27.94 46.91,27.86 U3.11
  Bottom 0.203: v46.99,27.94 46.99,16.51 J6.1
DN_LED
  Top 0.203: J4.3 36.83,5.08 36.83,14.82 R1.2 38.6,16.59 U3.40
DO
  Top 0.203: J6.4 49.4,18.92 49.4,26.67 48.72,27.36 U3.10
DP_HV
  Top 0.203: 10.93,8.38 10.93,6.03 J5.B6 | J5.A6 9.91,8.13 10.16,8.38 10.93,8.38 | 10.93,8.38 11.43,8.88 R11.1
GND  (via drill 0.38)
  Top 0.203: U3.23 36.91,27.86 v37.08,27.69 38.52,27.69 39.08,28.24 U3.15 39.08,30.19 40.64,31.75 C3.1 | U3.35 36.14,23.06 36.83,23.75 v37.85,23.75 39.37,23.75 40.06,23.06 U3.43 40.06,21.28 40.64,20.7 C5.2 | v44.7,24.64 44.44,24.9 U3.5
  other vias: 5.08,19.05 34.42,21.08 36.45,26.16 40.64,6.35 38.1,6.35 35.56,6.35 33.02,6.35 30.48,6.35 27.94,6.35 25.4,6.35 22.86,6.35 20.32,6.35 17.78,6.35
  pour Top (isolate 0.305): 0,0 57.15,0 57.15,40.64 0,40.64
  pour Bottom (isolate 0.305): 0,0 57.15,0 57.15,40.64 0,40.64
LF_LED
  Top 0.203: U3.39 38.1,17.53 36.66,16.09 R2.2 34.29,14.82 34.29,5.08 J4.5
N$1
  Top 0.203: U3.16 38.6,30.34 39.62,31.37 39.62,34.79 | Y1.1 39.62,34.79 | 39.62,34.79 40.29,34.79 C3.2
N$2
  Top 0.203: C1.2 35.91,33.79 Y1.3 37.42,32.81 37.72,32.51 38.23,32.51 38.48,32.26 38.48,31.88 38.23,31.62 37.72,31.62 37.47,31.37 37.47,30.99 38.1,30.35 U3.17
N$3
  Top 0.203: R10.1 D1.A
N$4
  Top 0.203: R1.1 D2.A
N$5
  Top 0.203: R2.1 D3.A
N$6
  Top 0.203: R3.1 D4.A
N$7
  Top 0.203: R4.1 D5.A
N$8
  Top 0.203: R5.1 D6.A
N$9
  Top 0.203: R13.1 8.91,10.56 J5.A5
N$10
  Top 0.203: J5.B5 11.91,8.62 12.7,9.41 R16.1
N$11
  Top 0.203: D8.A R7.1
N$12
  Top 0.203: R6.1 D7.A
N$13  (via drill 0.38)
  Top 0.203: R19.1 v55.5,30.48
  Bottom 0.203: v55.5,30.48 54.98,29.96 JP2.2
N$14  (via drill 0.38)
  Top 0.203: LED1.A v55.5,31.75
  Bottom 0.203: v55.5,31.75 54.75,31 JP2.1
N$21  (via drill 0.38)
  Top 0.203: v29.21,33.02 30.48,31.75 R17.2
  Bottom 0.203: v29.21,33.02 JP1.3
N$22  (via drill 0.38)
  Top 0.203: R18.2 v32.13,30.48
  Bottom 0.203: v32.13,30.48 31.09,29.44 JP1.1
N$23
  Top 0.203: D10.A R9.1
N$24
  Top 0.203: D9.A R8.1
NES_CLK  (via drill 0.38)
  Top 0.203: U3.12 40.56,27.98 v40.13,27.56
  Bottom 0.203: v40.13,27.56 34.58,22.01 33.94,22.01 29.71,17.78 15.11,17.78 J7.2
NES_DATA
  Top 0.203: J7.4 23.5,19.68 24.51,20.7 30.23,20.7 31.11,21.59 31.11,23.62 32.89,25.4 U3.28
NES_LATCH
  Top 0.203: J7.3 17.53,19.68 19.18,21.34 19.18,22.99 20.45,24.26 30.23,24.26 32.35,26.38 U3.26
RT_LED
  Top 0.203: U3.38 37.6,17.79 36.96,17.14 34.08,17.14 R3.2 31.75,14.82 31.75,5.08 J4.7
SCK
  Top 0.203: J6.3 46.99,19.05 46.99,25.4 45.51,26.88 U3.9
SCL  (via drill 0.38)
  Top 0.203: J1.4 53.44,18.01 v53.47,18.03 | v53.47,26.92 53.44,26.9 J2.4 | U3.18 37.6,30.22 v36.45,31.37 36.07,31.75 R17.1
  Bottom 0.203: v36.45,31.37 37.34,30.48 49.91,30.48 v53.47,26.92 v53.47,18.03 53.47,8.89 50.8,6.22 J3.4
SDA  (via drill 0.38)
  Top 0.203: v54.36,17.02 54.35,17.01 J1.3 v49.53,17.02 | v54.36,25.91 54.35,25.9 J2.3 v50.55,25.91 | U3.19 37.12,29.3 v36.39,30.04 35.94,30.48 R18.1
  Bottom 0.203: v54.36,17.02 v54.36,25.91 | v36.39,30.04 48.2,30.04 50.55,27.69 v50.55,25.91 | v49.53,17.02 49.53,8.89 48.26,7.62 J3.3
SELECT_LED
  Top 0.203: U3.36 36.62,18.33 36.45,18.16 30.01,18.16 R5.2 26.67,14.82 26.67,5.08 J4.11
START_LED
  Top 0.203: U3.37 37.12,18.07 36.7,17.65 32.04,17.65 R4.2 29.21,14.82 29.21,5.08 J4.9
UCAP
  Top 0.203: U3.6 42.2,25.4 C12.1
UP_LED
  Top 0.203: U3.41 39.08,16.42 39.37,16.13 | J4.1 39.37,5.08 39.37,16.13 | R10.2 40.6,16.13 39.37,16.13
USB_RAW
  Top 0.203: F1.2 2.54,15.24 D12.A
V_USB  (via drill 0.38)
  Top 0.203: U3.7 40.76,25.9 40.51,25.65 40.51,23.75 40.82,23.44 U3.2 42.6,23.44 43.18,22.86 v43.18,19.05 | v13.97,8.89 13.08,8.89 12.61,8.42 J5.VBUS2
  Top 0.254: J5.VBUS1 7.71,8.42 v7.62,8.51 | v1.27,17.4 v1.28,17.41 F1.1 C9.1
  Bottom 0.203: v43.18,19.05 33.02,8.89 v13.97,8.89
  Bottom 0.254: v1.27,17.4 1.27,8.89 1.65,8.51 v7.62,8.51 12.7,8.51 13.08,8.89 v13.97,8.89
ZAP_LIGHT
  Top 0.203: J7.6 20.07,24.77 29.84,24.77 31.96,26.88 U3.25
ZAP_LIGHT_LED
  Top 0.203: U3.29 33.28,24.9 33.27,24.89 33.15,24.89 31.62,23.37 31.62,21.34 30.48,20.19 24.64,20.19 22.1,17.65 19.34,17.65 R9.2 16.51,14.82 16.51,5.08 J4.19
ZAP_TRIG_LED
  Top 0.203: U3.30 33.44,24.42 32.13,23.11 32.13,21.08 30.73,19.68 24.89,19.68 22.35,17.14 21.38,17.14 R8.2 19.05,14.82 19.05,5.08 J4.17
ZAP_TRIGGER
  Top 0.203: J7.5 28.7,21.97 32.63,25.9 U3.27

### Text on the board
Bottom: x02
tDocu: NPOOLE